# EAGLE design control (EAGLE 7.7.0)
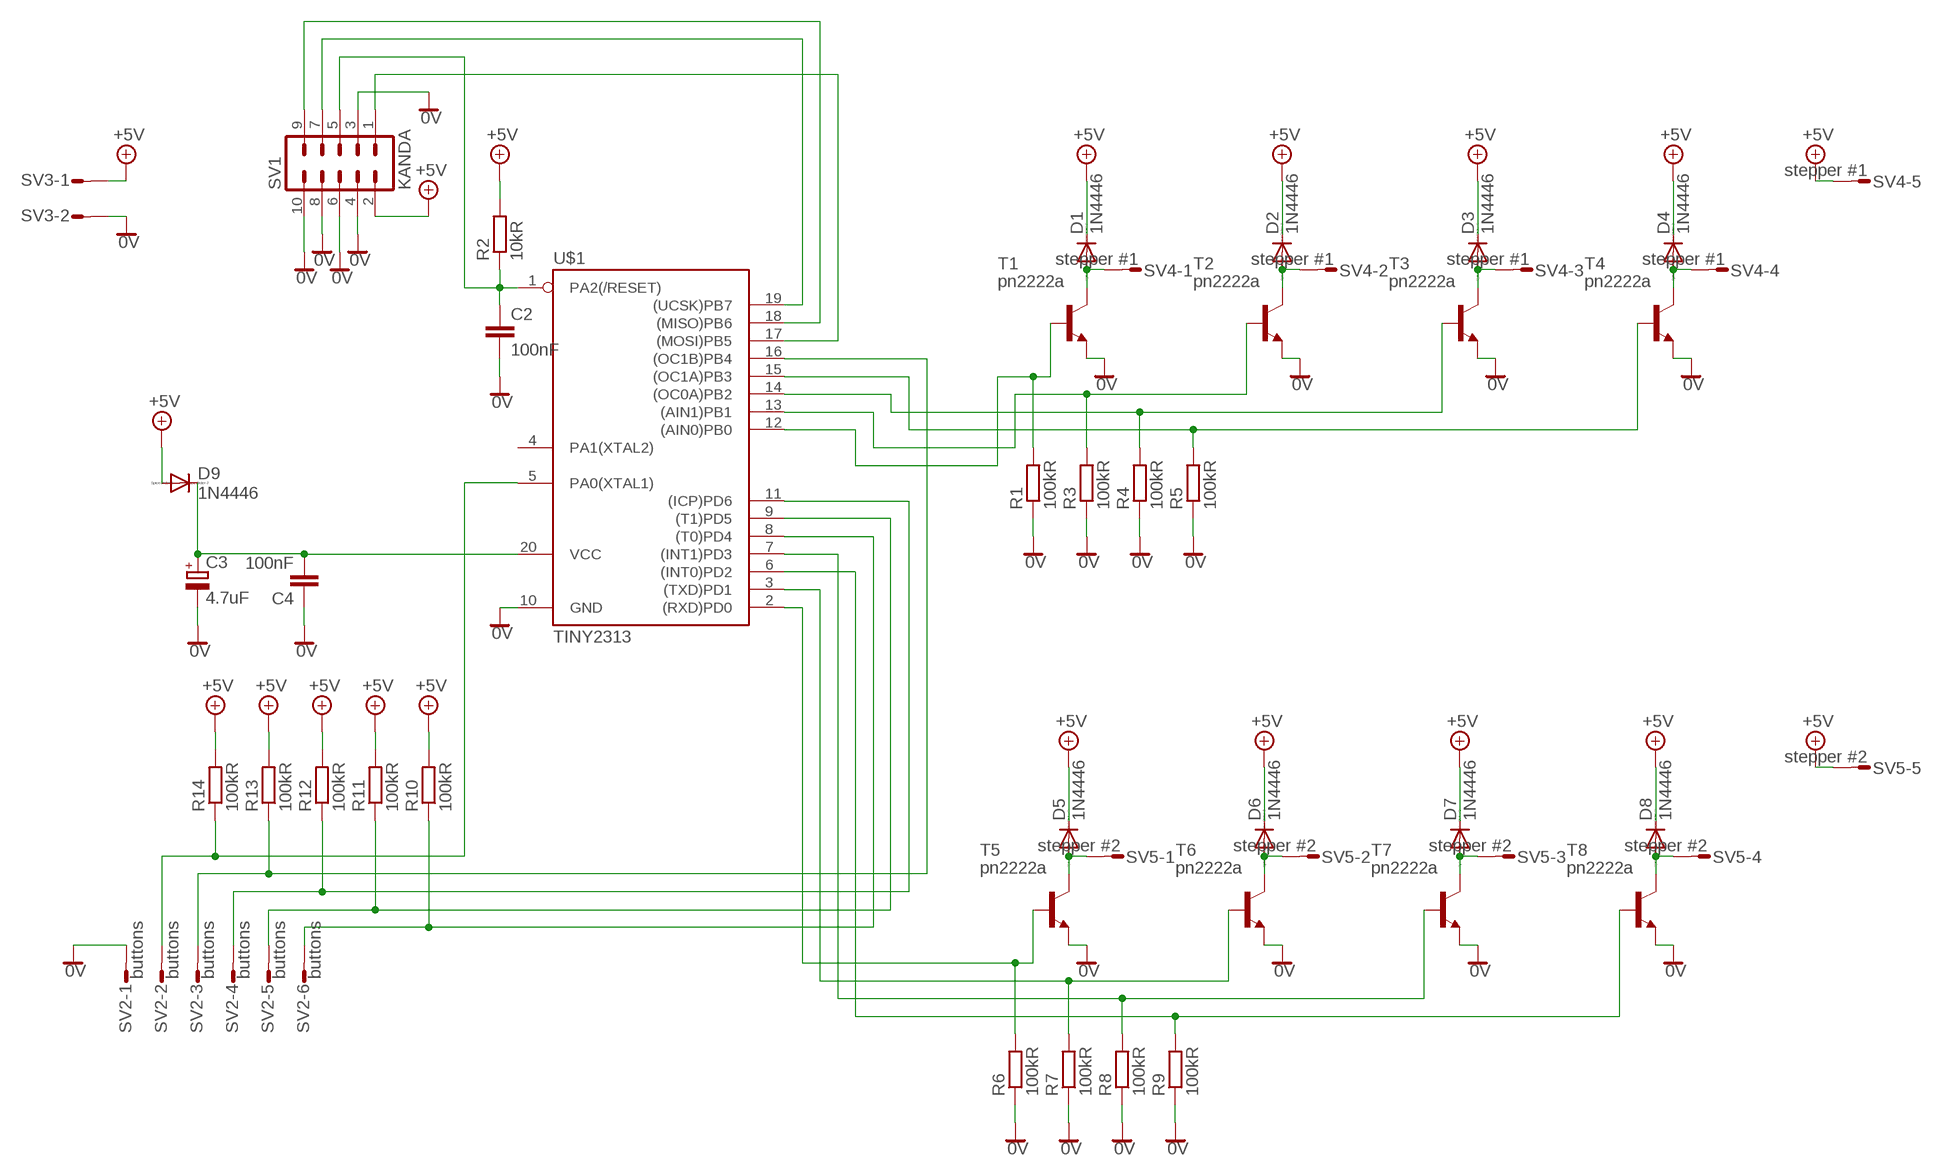
[diagram p0: schematic, sheet 1]

## Parts
C2  100nF  C-EUC3216  [C3216]
C3  4.7uF  CPOL-EU153CLV-0405  [153CLV-0405]
C4  100nF  C-EUC3216  [C3216]
D1  1N4446  [DO35-10]
D2  1N4446  [DO35-10]
D3  1N4446  [DO35-10]
D4  1N4446  [DO35-10]
D5  1N4446  [DO35-10]
D6  1N4446  [DO35-10]
D7  1N4446  [DO35-10]
D8  1N4446  [DO35-10]
D9  1N4446  [DO35-10]
R1  100kR  R-EU_MELF0204W  [MINI_MELF-0204W]
R2  10kR  R-EU_MELF0204W  [MINI_MELF-0204W]
R3  100kR  R-EU_MELF0204W  [MINI_MELF-0204W]
R4  100kR  R-EU_MELF0204W  [MINI_MELF-0204W]
R5  100kR  R-EU_MELF0204W  [MINI_MELF-0204W]
R6  100kR  R-EU_MELF0204W  [MINI_MELF-0204W]
R7  100kR  R-EU_MELF0204W  [MINI_MELF-0204W]
R8  100kR  R-EU_MELF0204W  [MINI_MELF-0204W]
R9  100kR  R-EU_MELF0204W  [MINI_MELF-0204W]
R10  100kR  R-EU_MELF0204W  [MINI_MELF-0204W]
R11  100kR  R-EU_MELF0204W  [MINI_MELF-0204W]
R12  100kR  R-EU_MELF0204W  [MINI_MELF-0204W]
R13  100kR  R-EU_MELF0204W  [MINI_MELF-0204W]
R14  100kR  R-EU_MELF0204W  [MINI_MELF-0204W]
SV1  KANDA  ML10  [ML10]
SV2  buttons  S06P  [S06P]
SV3  S02P  [S02P]
SV4  stepper #1  S05P  [S05P]
SV5  stepper #2  S05P  [S05P]
T1  pn2222a  MPS2222A-NPN-TO92-CBE  [TO92-CBE]
T2  pn2222a  MPS2222A-NPN-TO92-CBE  [TO92-CBE]
T3  pn2222a  MPS2222A-NPN-TO92-CBE  [TO92-CBE]
T4  pn2222a  MPS2222A-NPN-TO92-CBE  [TO92-CBE]
T5  pn2222a  MPS2222A-NPN-TO92-CBE  [TO92-CBE]
T6  pn2222a  MPS2222A-NPN-TO92-CBE  [TO92-CBE]
T7  pn2222a  MPS2222A-NPN-TO92-CBE  [TO92-CBE]
T8  pn2222a  MPS2222A-NPN-TO92-CBE  [TO92-CBE]
U$1  TINY2313  TINY2313-*P*  [DIL20]

## Nets
0V: C2.2 C3.- C4.1 R1.1 R3.1 R4.1 R5.1 R6.1 R7.1 R8.1 R9.1 SV1.3 SV1.4 SV1.6 SV1.8 SV1.10 SV2.1 SV3.2 T1.E T2.E T3.E T4.E T5.E T6.E T7.E T8.E U$1.10(GND)
+5V: D1.C D2.C D3.C D4.C D5.C D6.C D7.C D8.C D9.A R2.2 R10.2 R11.2 R12.2 R13.2 R14.2 SV1.2 SV3.1 SV4.5 SV5.5
N$1: D5.A SV5.1 T5.C
N$2: R6.2 T5.B U$1.2((RXD)PD0)
N$3: R10.1 SV2.6 U$1.8((T0)PD4)
N$4: R7.2 T6.B U$1.3((TXD)PD1)
N$5: D7.A SV5.3 T7.C
N$6: R8.2 T7.B U$1.7((INT1)PD3)
N$7: D8.A SV5.4 T8.C
N$8: D1.A SV4.1 T1.C
N$9: R1.2 T1.B U$1.12((AIN0)PB0)
N$10: D2.A SV4.2 T2.C
N$11: R3.2 T2.B U$1.13((AIN1)PB1)
N$12: D3.A SV4.3 T3.C
N$13: R4.2 T3.B U$1.14((OC0A)PB2)
N$14: D4.A SV4.4 T4.C
N$15: R5.2 T4.B U$1.15((OC1A)PB3)
N$16: C2.1 R2.1 SV1.5 U$1.1(PA2(/RESET))
N$17: SV1.1 U$1.17((MOSI)PB5)
N$18: R9.2 T8.B U$1.6((INT0)PD2)
N$19: SV1.7 U$1.19((UCSK)PB7)
N$20: SV1.9 U$1.18((MISO)PB6)
N$21: D6.A SV5.2 T6.C
N$22: R11.1 SV2.5 U$1.9((T1)PD5)
N$23: R12.1 SV2.4 U$1.11((ICP)PD6)
N$24: R13.1 SV2.3 U$1.16((OC1B)PB4)
N$25: R14.1 SV2.2 U$1.5(PA0(XTAL1))
N$26: C3.+ C4.2 D9.C U$1.20(VCC)
Unconnected: U$1.4(PA1(XTAL2))

## Library data of the parts
C2 C4 = rcl:C-EU: CAPACITOR, European symbol
C3 = rcl:CPOL-EU: POLARIZED CAPACITOR, European symbol
D1-D9 = diode:1N4446: DIODE high speed (Philips)
R1-R14 = rcl:R-EU_: RESISTOR, European symbol
SV1 = con-harting-ml:ML10: HARTING
SV2 = con-amp-mt:S06P: AMP MT CONNECTOR; OC_FARNELL: unknown; OC_NEWARK: unknown
SV3 = con-amp-mt:S02P: AMP MT CONNECTOR; OC_FARNELL: unknown; OC_NEWARK: unknown
SV4 SV5 = con-amp-mt:S05P: AMP MT CONNECTOR; OC_FARNELL: unknown; OC_NEWARK: unknown
T1-T8 = transistor:*-NPN-: NPN Transistror BF959 corrected 2008.03.06
U$1 = avr-7:TINY2313*: Atmel Tiny2313 2K Flash, 128 bytes EEPROM, 128 bytes RAM

## Board
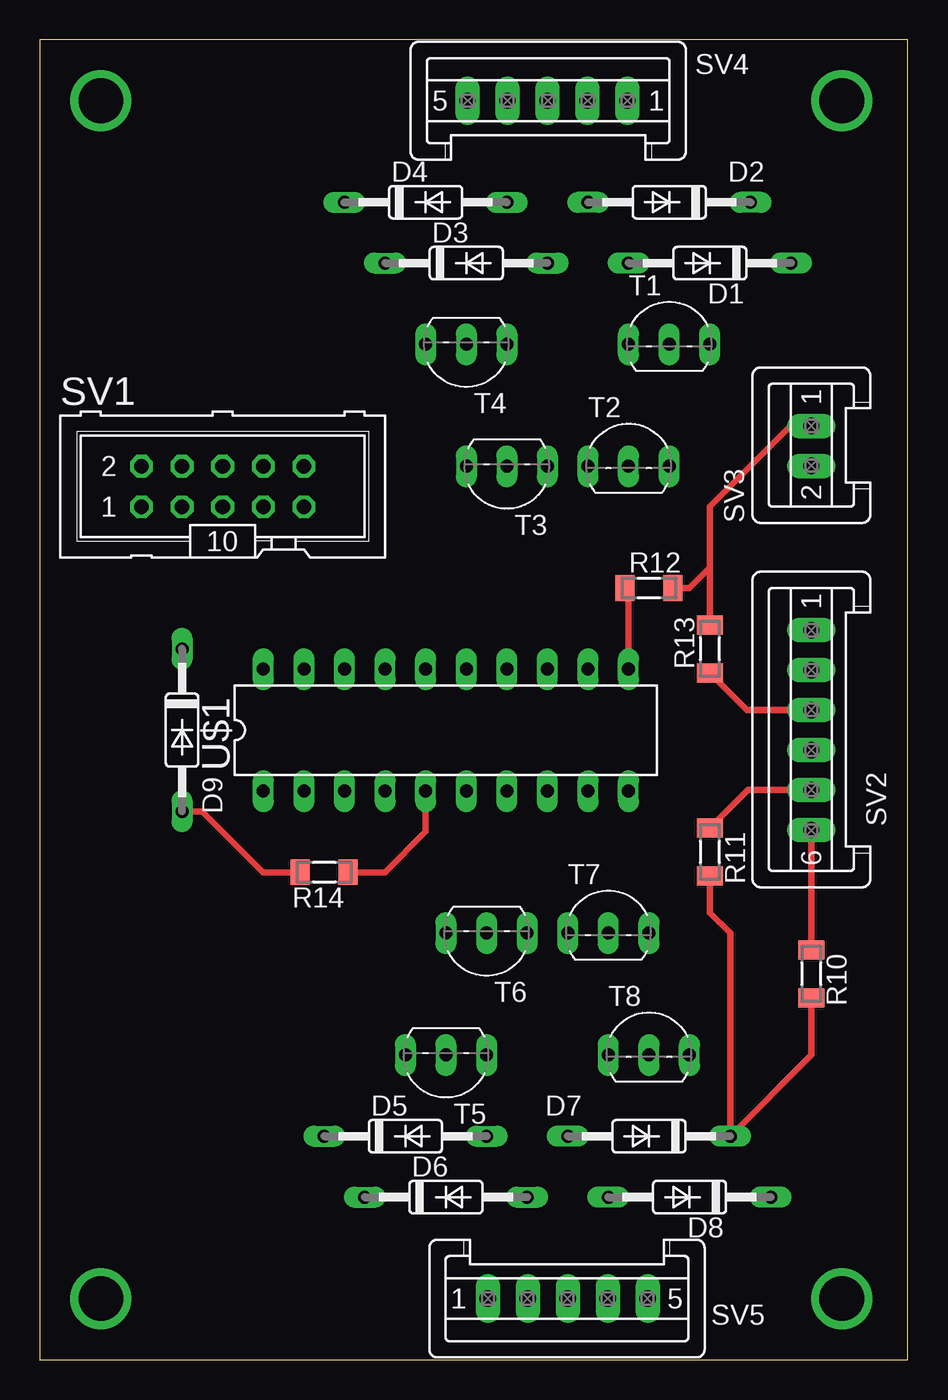
[diagram p1: board, top side]
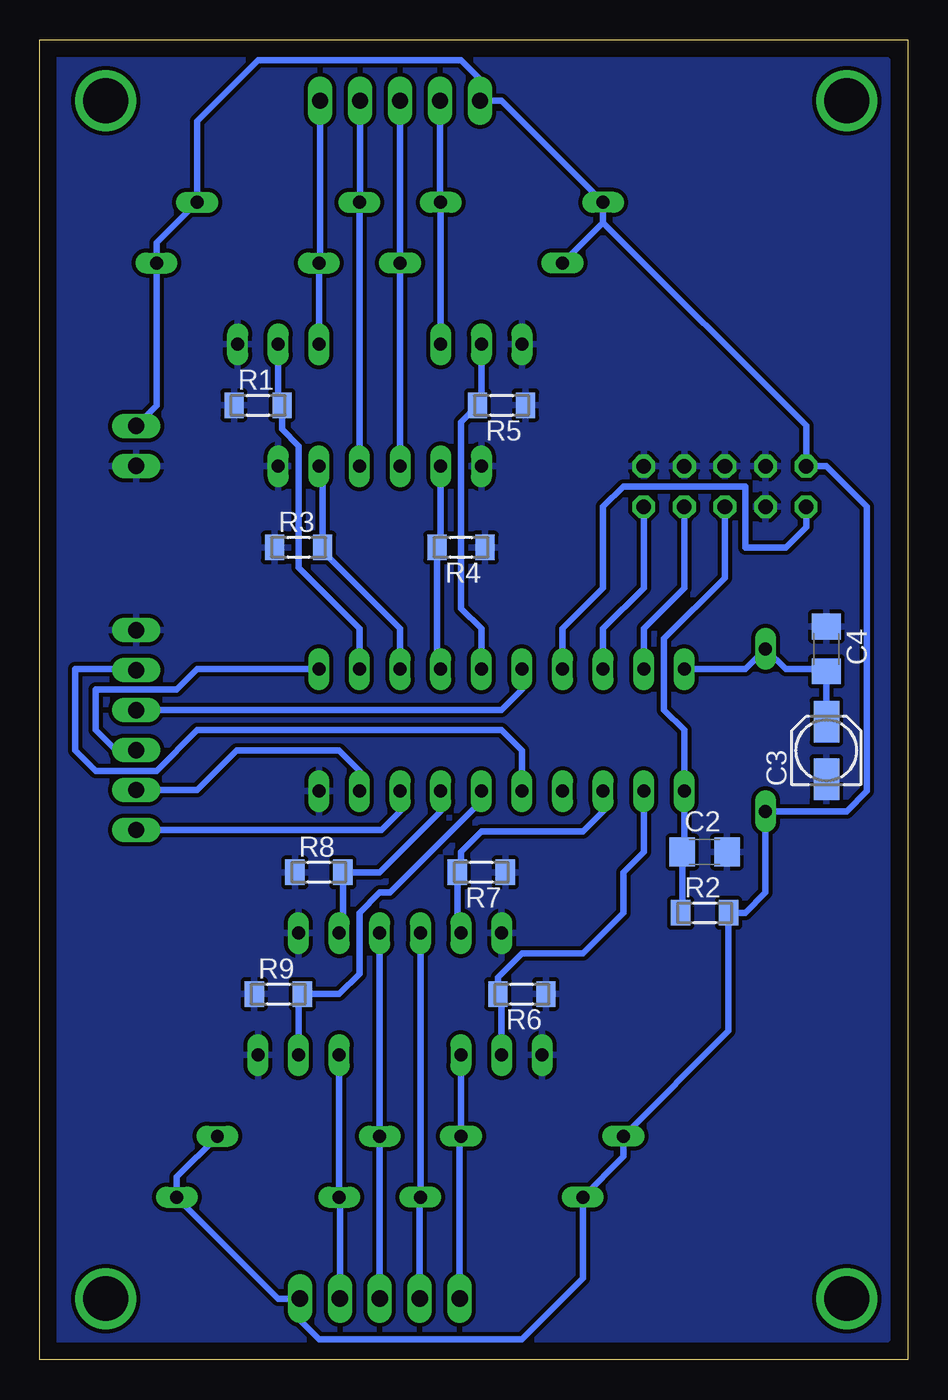
[diagram p2: board, bottom side, seen from below]

Size 54.28 x 82.54 mm. Coordinates in mm from the lower left corner, seen from the top.
Outline: 0,0 54.28,0 54.28,82.54 0,82.54 0,0
Copper layers (1*16): Top 0.035mm / dielectric 1.5mm / Bottom 0.035mm
Design rules "default": minimum track width 10mil, minimum drill 24mil, track to track 8mil, track to pad 8mil, pad to pad 8mil, via to via 8mil, smd to smd 8mil, copper to edge 40mil, drill to drill 8mil, minimum pad ring 10mil, minimum via ring 8mil, stop-mask expansion 4mil, vias tented up to drill 0mil, thermal gap 10mil

### Footprints (pad centres in the part's own frame; a part is rotated, then mirrored left to right if it is on the bottom)
C3216 = smd 1.6 x 1.8: 1 -1.4,0; 2 1.4,0
153CLV-0405 = smd 2.6 x 1.6: + 1.8,0; - -1.8,0
DO35-10 = drill 0.813 long: A 5.08,0; C -5.08,0
MINI_MELF-0204W = smd 1.2 x 1.6: 1 -1.5,0; 2 1.5,0
ML10 = drill 0.914 octagon: 1 -5.08,-1.27; 2 -5.08,1.27; 3 -2.54,-1.27; 4 -2.54,1.27; 5 0,-1.27; 6 0,1.27; 7 2.54,-1.27; 8 2.54,1.27; 9 5.08,-1.27; 10 5.08,1.27
S06P = drill 1.016 long: 1 6.25,0; 2 3.75,0; 3 1.25,0; 4 -1.25,0; 5 -3.75,0; 6 -6.25,0
S02P = drill 1.016 long: 1 1.25,0; 2 -1.25,0
S05P = drill 1.016 long: 1 5,0; 2 2.5,0; 3 0,0; 4 -2.5,0; 5 -5,0
TO92-CBE = drill 0.813 long: B 0,0; C -2.54,0; E 2.54,0
DIL20 = drill 0.813 long: 1 -11.43,-3.81; 2 -8.89,-3.81; 3 -6.35,-3.81; 4 -3.81,-3.81; 5 -1.27,-3.81; 6 1.27,-3.81; 7 3.81,-3.81; 8 6.35,-3.81; 9 8.89,-3.81; 10 11.43,-3.81; 11 11.43,3.81; 12 8.89,3.81; 13 6.35,3.81; 14 3.81,3.81; 15 1.27,3.81; 16 -1.27,3.81; 17 -3.81,3.81; 18 -6.35,3.81; 19 -8.89,3.81; 20 -11.43,3.81

### Placement (x,y rotation side)
C2  12.7,31.75 0 bottom
C3  5.08,38.1 90 bottom
C4  5.08,44.45 270 bottom
D1  41.91,68.58 180 top
D2  39.37,72.39 180 top
D3  26.67,68.58 0 top
D4  24.13,72.39 0 top
D5  22.86,13.97 0 top
D6  25.4,10.16 0 top
D7  38.1,13.97 180 top
D8  40.64,10.16 180 top
D9  8.89,39.37 270 top
R1  40.64,59.69 0 bottom
R2  12.7,27.94 0 bottom
R3  38.1,50.8 0 bottom
R4  27.94,50.8 180 bottom
R5  25.4,59.69 180 bottom
R6  24.13,22.86 180 bottom
R7  26.67,30.48 180 bottom
R8  36.83,30.48 0 bottom
R9  39.37,22.86 0 bottom
R10  48.26,24.13 270 top
R11  41.91,31.75 270 top
R12  38.1,48.26 0 top
R13  41.91,44.45 90 top
R14  17.78,30.48 180 top
SV1  11.43,54.61 0 top
SV2  48.26,39.37 90 top
SV3  48.26,57.15 90 top
SV4  31.75,78.74 0 top
SV5  33.02,3.81 180 top
T1  39.37,63.5 0 top
T2  36.83,55.88 0 top
T3  29.21,55.88 180 top
T4  26.67,63.5 180 top
T5  25.4,19.05 180 top
T6  27.94,26.67 180 top
T7  35.56,26.67 0 top
T8  38.1,19.05 0 top
U$1  25.4,39.37 0 top

### Tracks (layer width: path | path; a pad name or v marks a point on that pad's centre or on a via)
0V
  pour Bottom (isolate 0.254): 53.34,81.28 53.34,1.27 1.27,1.27 1.27,81.28
+5V
  Top 0.406: R10.2 48.26,19.05 D7.C 43.18,26.67 41.91,27.94 R11.2 | D9.A 10.16,34.29 13.97,30.48 R14.2 | R13.2 41.91,49.53 | 41.91,49.53 41.91,53.34 46.99,58.42 48.24,58.42 SV3.1 | R12.2 40.64,48.26 41.91,49.53
  Bottom 0.406: D7.C 45.72,11.43 D8.C 39.37,3.81 SV5.5 38.02,2.46 36.83,1.27 24.13,1.27 20.32,5.08 D6.C 17.78,12.7 D5.C 11.2,20.55 R2.2 10.16,27.94 8.89,29.21 D9.A 3.81,34.29 2.54,35.56 2.54,53.34 5.08,55.88 SV1.2 6.35,58.42 19.05,71.12 | 19.05,71.12 D4.C 25.4,78.74 SV4.5 26.75,80.09 27.94,81.28 40.64,81.28 44.45,77.47 D2.C 46.99,69.85 D1.C 46.99,59.67 SV3.1 | 19.05,71.12 D3.C
N$1
  Bottom 0.406: SV5.1 28.02,13.89 D5.A T5.C
N$2
  Bottom 0.406: T5.B 25.4,22.63 R6.2 25.63,23.9 24.13,25.4 20.32,25.4 17.78,27.94 17.78,30.48 16.51,31.75 U$1.2
N$3
  Top 0.406: R10.1 SV2.6
  Bottom 0.406: SV2.6 32.92,33.12 31.75,34.29 U$1.8
N$4
  Bottom 0.406: T6.B 28.17,26.9 R7.2 27.94,30.71 27.94,31.75 26.67,33.02 20.32,33.02 19.05,34.29 U$1.3
N$5
  Bottom 0.406: SV5.3 D7.A T7.C
N$6
  Bottom 0.406: T7.B 35.33,26.9 R8.2 33.02,30.48 29.21,34.29 U$1.7
N$7
  Bottom 0.406: SV5.4 35.52,10.12 D8.A T8.C
N$8
  Bottom 0.406: SV4.1 36.75,68.66 D1.A T1.C
N$9
  Bottom 0.406: T1.B 39.37,59.92 R1.2 39.14,58.19 38.1,57.15 38.1,49.53 34.29,45.72 U$1.12
N$10
  Bottom 0.406: SV4.2 34.25,72.43 D2.A T2.C
N$11
  Bottom 0.406: T2.B 36.6,55.65 R3.2 36.6,50.57 31.75,45.72 U$1.13
N$12
  Bottom 0.406: SV4.3 D3.A T3.C
N$13
  Bottom 0.406: T3.B 29.21,51.03 R4.2 29.44,43.41 U$1.14
N$14
  Bottom 0.406: SV4.4 29.25,72.43 D4.A T4.C
N$15
  Bottom 0.406: T4.B 26.67,59.92 R5.2 27.94,58.65 27.94,46.99 26.67,45.72 U$1.15
N$16
  Bottom 0.406: R2.1 14.1,28.04 C2.1 13.97,31.88 U$1.1 13.97,39.37 15.24,40.64 15.24,45.09 11.43,48.9 SV1.5
N$17
  Bottom 0.406: U$1.17 21.59,45.72 19.05,48.26 19.05,53.34 17.78,54.61 10.16,54.61 10.16,50.8 7.62,50.8 6.35,52.07 SV1.1
N$18
  Bottom 0.406: T8.B 38.1,22.63 R9.2 35.56,22.86 34.29,24.13 34.29,27.94 33.02,29.21 32.38,29.21 26.67,34.93 U$1.6
N$19
  Bottom 0.406: U$1.19 16.51,45.72 13.97,48.26 SV1.7
N$20
  Bottom 0.406: SV1.9 16.51,48.26 19.05,45.72 U$1.18
N$21
  Bottom 0.406: SV5.2 30.52,10.12 D6.A T6.C
N$22
  Top 0.406: SV2.5 44.28,35.62 R11.1
  Bottom 0.406: U$1.9 34.29,36.83 35.56,38.1 41.97,38.1 44.45,35.62 SV2.5
N$23
  Top 0.406: U$1.11 36.83,48.03 R12.1
  Bottom 0.406: SV2.4 49.55,38.12 50.8,39.37 50.8,41.91 45.72,41.91 44.45,43.18 U$1.11
N$24
  Top 0.406: SV2.3 44.24,40.62 R13.1
  Bottom 0.406: SV2.3 25.42,40.62 24.13,41.91 U$1.16
N$25
  Top 0.406: U$1.5 24.13,33.02 21.59,30.48 R14.1
  Bottom 0.406: U$1.5 24.13,38.1 25.4,39.37 44.45,39.37 46.99,36.83 50.8,36.83 52.07,38.1 52.07,43.18 48.32,43.18 SV2.2
N$26
  Bottom 0.406: U$1.20 10.16,43.18 D9.C 7.62,43.18 5.21,43.18 C4.2 C3.+
N$27  (via drill 2.8 pad 2.54)
  other vias: 3.81,3.81
N$28  (via drill 2.8 pad 2.54)
  other vias: 50.16,3.81
N$29  (via drill 2.8 pad 2.54)
  other vias: 50.16,78.74
N$30  (via drill 2.8 pad 2.54)
  other vias: 3.81,78.74

### Text on the board
tDocu: +5V | GND | Lemur's Bobik / control board / v1.0